# Altium schematic sheet VCO_HMC8364.SchDoc
size A3; SheetNumber: 15; SheetTotal: 26
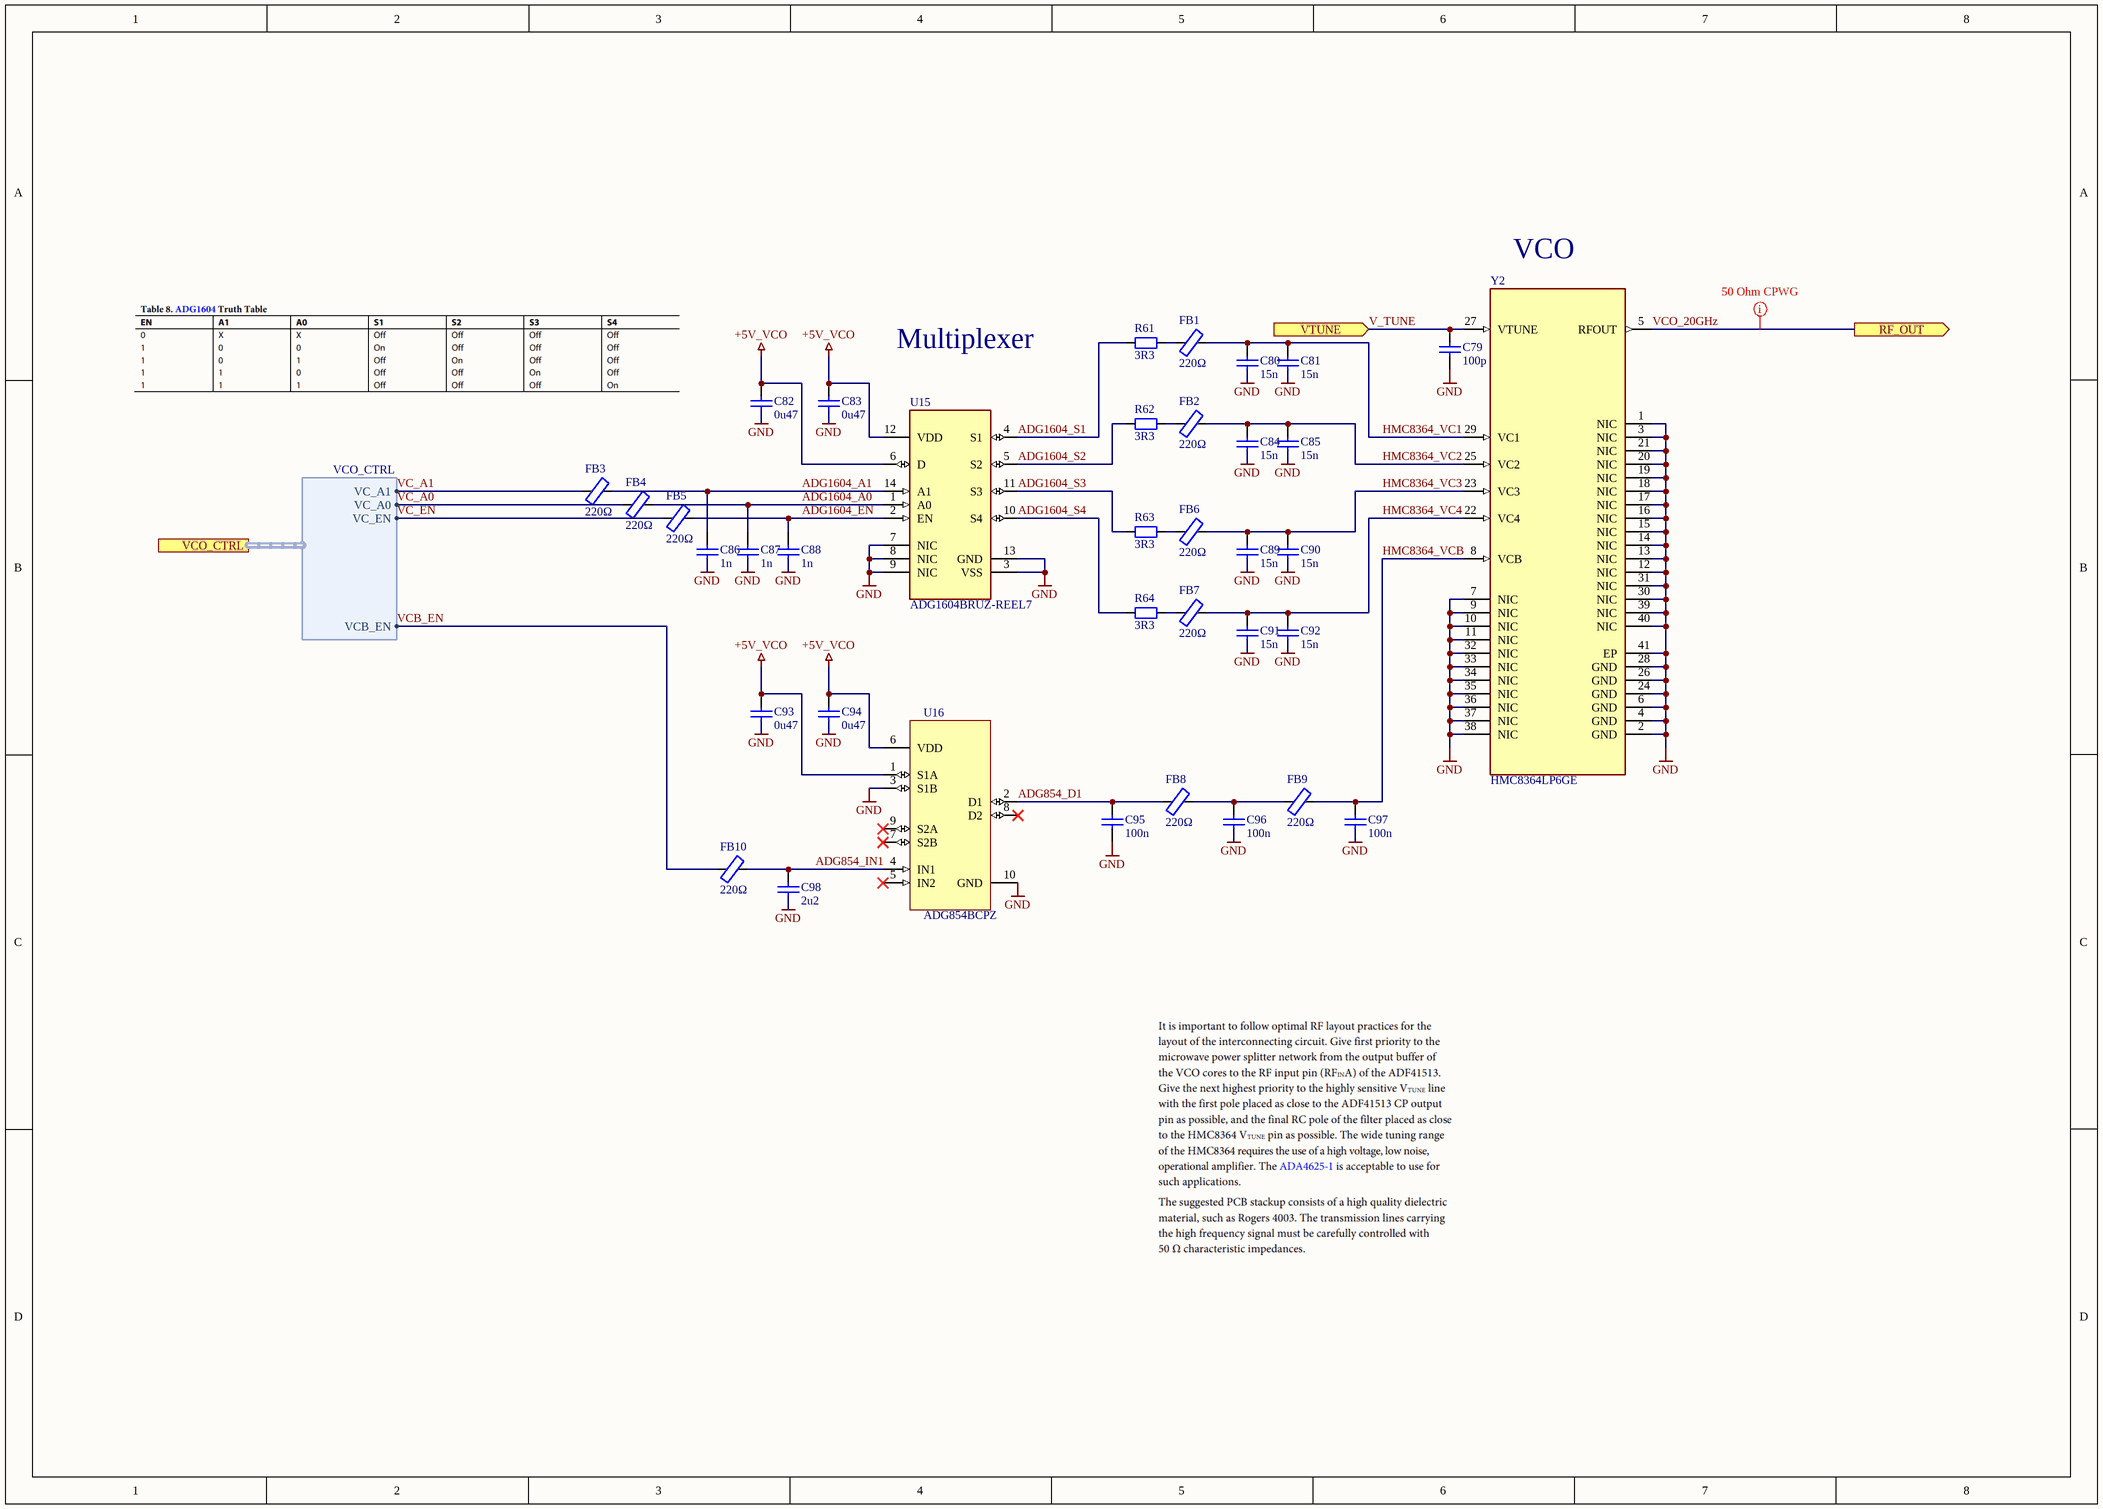
[diagram p0: VCO_HMC8364.SchDoc]

## Parts
C79  100p  [C_0402_1005Metric_IPC_N]
C80  15n  [C_0402_1005Metric_IPC_N]
C81  15n  [C_0402_1005Metric_IPC_N]
C82  0u47  [C_0402_1005Metric_IPC_N]
C83  0u47  [C_0402_1005Metric_IPC_N]
C84  15n  [C_0402_1005Metric_IPC_N]
C85  15n  [C_0402_1005Metric_IPC_N]
C86  1n  [C_0402_1005Metric_IPC_N]
C87  1n  [C_0402_1005Metric_IPC_N]
C88  1n  [C_0402_1005Metric_IPC_N]
C89  15n  [C_0402_1005Metric_IPC_N]
C90  15n  [C_0402_1005Metric_IPC_N]
C91  15n  [C_0402_1005Metric_IPC_N]
C92  15n  [C_0402_1005Metric_IPC_N]
C93  0u47  [C_0402_1005Metric_IPC_N]
C94  0u47  [C_0402_1005Metric_IPC_N]
C95  100n  [C_0402_1005Metric_IPC_N]
C96  100n  [C_0402_1005Metric_IPC_N]
C97  100n  [C_0402_1005Metric_IPC_N]
C98  2u2  [C_0402_1005Metric_IPC_N]
FB1  220Ω  [L_0402_1005Metric_IPC_N]
FB2  220Ω  [L_0402_1005Metric_IPC_N]
FB3  220Ω  [L_0402_1005Metric_IPC_N]
FB4  220Ω  [L_0402_1005Metric_IPC_N]
FB5  220Ω  [L_0402_1005Metric_IPC_N]
FB6  220Ω  [L_0402_1005Metric_IPC_N]
FB7  220Ω  [L_0402_1005Metric_IPC_N]
FB8  220Ω  [L_0402_1005Metric_IPC_N]
FB9  220Ω  [L_0402_1005Metric_IPC_N]
FB10  220Ω  [L_0402_1005Metric_IPC_N]
R61  3R3  [R_0402_1005Metric_IPC_N]
R62  3R3  [R_0402_1005Metric_IPC_N]
R63  3R3  [R_0402_1005Metric_IPC_N]
R64  3R3  [R_0402_1005Metric_IPC_N]
U15  ADG1604BRUZ-REEL7  [TSSOP65P640X120-14N]
U16  ADG854BCPZ  [LFCSP_UQ-10-1EP_1.3x1.6mm_P0.4mm_IPC_N]
Y2  HMC8364LP6GE  [LFCSP-40-1EP_6x6mm_P0.5mm_EP4.7x4.7mm_IPC_N]

## Ports
RF_OUT (out, see Top_Level[4B]), VCO_CTRL (harness VCO_CTRL, see Top_Level[3B], MCU[5C]), VTUNE (in, see Top_Level[3B])

## Harnesses
VCO_CTRL: VC_A1, VC_A0, VC_EN, VCB_EN

## Nets
+5V_VCO: C82.2 C83.2 C93.2 C94.2 U15.6(D) U15.12(VDD) U16.1(S1A) U16.6(VDD)
GND: C79.1 C80.1 C81.1 C82.1 C83.1 C84.1 C85.1 C86.1 C87.1 C88.1 C89.1 C90.1 C91.1 C92.1 C93.1 C94.1 C95.1 C96.1 C97.1 C98.1 U15.3(VSS) U15.7(NIC) U15.8(NIC) U15.9(NIC) U15.13(GND) U16.3(S1B) U16.10(GND) Y2.1(NIC) Y2.2(GND) Y2.3(NIC) Y2.4(GND) Y2.6(GND) Y2.7(NIC) Y2.9(NIC) Y2.10(NIC) Y2.11(NIC) Y2.12(NIC) Y2.13(NIC) Y2.14(NIC) Y2.15(NIC) Y2.16(NIC) Y2.17(NIC) Y2.18(NIC) Y2.19(NIC) Y2.20(NIC) Y2.21(NIC) Y2.24(GND) Y2.26(GND) Y2.28(GND) Y2.30(NIC) Y2.31(NIC) Y2.32(NIC) Y2.33(NIC) Y2.34(NIC) Y2.35(NIC) Y2.36(NIC) Y2.37(NIC) Y2.38(NIC) Y2.39(NIC) Y2.40(NIC) Y2.41(EP)
ADG854_D1: C95.2 FB8.1 U16.2(D1)
ADG854_IN1: C98.2 FB10.2 U16.4(IN1)
ADG1604_A0: C87.2 FB4.2 U15.1(A0)
ADG1604_A1: C86.2 FB3.2 U15.14(A1)
ADG1604_EN: C88.2 FB5.2 U15.2(EN)
ADG1604_S1: R61.1 U15.4(S1)
ADG1604_S2: R62.1 U15.5(S2)
ADG1604_S3: R63.1 U15.11(S3)
ADG1604_S4: R64.1 U15.10(S4)
HMC8364_VC1: C80.2 C81.2 FB1.2 Y2.29(VC1)
HMC8364_VC2: C84.2 C85.2 FB2.2 Y2.25(VC2)
HMC8364_VC3: C89.2 C90.2 FB6.2 Y2.23(VC3)
HMC8364_VC4: C91.2 C92.2 FB7.2 Y2.22(VC4)
HMC8364_VCB: C97.2 FB9.2 Y2.8(VCB)
V_TUNE: C79.2 Y2.27(VTUNE) ; port VTUNE
VC_A0: FB4.1 ; port VCO_CTRL.VC_A0
VC_A1: FB3.1 ; port VCO_CTRL.VC_A1
VC_EN: FB5.1 ; port VCO_CTRL.VC_EN
VCB_EN: FB10.1 ; port VCO_CTRL.VCB_EN
VCO_20GHz: Y2.5(RFOUT) ; port RF_OUT
NetC96_2: C96.2 FB8.2 FB9.1
NetFB1_1: FB1.1 R61.2
NetFB2_1: FB2.1 R62.2
NetFB6_1: FB6.1 R63.2
NetFB7_1: FB7.1 R64.2

Not connected (* = marked no-connect by the designer): U16 5(IN2)* 7(S2B)* 8(D2)* 9(S2A)*

## Layout directives
net class 50Ohm_CPWG: VCO_20GHz

## Notes on the sheet
- VCO
- Multiplexer

## Library data of the parts
C79-C81 C84 C85 C89-C92 C98 = C000002: Generic MLCC with 0402 Footprint; Specific Component: False; Voltage Rated: 50V; ID: C000002; Tolerance: *; Temp Coefficient: *; min Temperature: *; max Temperature: *; Case: 0402
  C79: Capacitance: 100p
  C80 C81 C84 C85 C89-C92: Capacitance: 15n
  C98: Capacitance: 2u2
C82 C86-C88 C93 = C000002: Generic MLCC with 0402 Footprint; Specific Component: False; ID: C000002; Tolerance: *; Temp Coefficient: *; Voltage Rated: *; min Temperature: *; max Temperature: *; Case: 0402
  C82 C93: Capacitance: 0u47
  C86-C88: Capacitance: 1n
C83 C94-C97 = C000002: Generic MLCC with 0402 Footprint; Specific Component: False; Tolerance: 10%; Temp Coefficient: X7R; Voltage Rated: 50V; ID: C000002; min Temperature: *; max Temperature: *; Case: 0402; Supplier 1: Mouser; Supplier Part Number 1: 81-GRM155R71H104KE4D; Supplier 2: Digikey; Supplier Part Number 2: 490-10700-1-ND
  C83 C94: Capacitance: 0u47
  C95-C97: Capacitance: 100n
FB1-FB10 = L000016: Ferrite Beads, 220Ω, 0.3A, *, 700m, *, 0402; Manufacturer: Murata Electronics; Manufacturer Part Number: BLM15GG221SN1D; Specific Component: True; min Temperature: -55; max Temperature: +125; ID: L000016; Type: Ferrite Beads; Inductance: 220Ω; Tolerance: *; Current Rating: 0.3A; Current - Saturation: *; DC resistance: 700m; Q @ Freq: *; Frequency - Self Resonant: *; Case: 0402; ComponentLink1Description: Datasheet; ComponentLink1URL: https://www.mouser.de/datasheet/3/76/1/ENFA0029.pdf; Supplier 1: Digikey; Supplier Part Number 1: 490-5197-1-ND; Supplier 2: Mouser; Supplier Part Number 2: 81-BLM15GG221SN1D
R61-R64 = R000002: Generic Chip Resistor with 0402 Footprint; Specific Component: False; ID: R000002; Resistance: 3R3; Tolerance: *; Power Rating: *; Composition: *; min Temperature: *; max Temperature: *; Temp Coefficient: *; Case: 0402
U15 = LG000020: Manufacturer: Analog Devices; ID: LG000020; Type: Multiplexer; Manufacturer Part Number: ADG1604BRUZ-REEL7; Part Value: ADG1604BRUZ-REEL7; Case: TSSOP-14; ComponentLink1Description: Datasheet; ComponentLink1URL: https://www.analog.com/media/en/technical-documentation/data-sheets/ADG1604.pdf; Supplier 1: Digikey; Supplier Part Number 1: ADG1604BRUZ-REEL7CT-ND; Supplier 2: Mouser; Supplier Part Number 2: 584-ADG1604BRUZ-R7
U16 = LG000021: Manufacturer: Analog Devices; ID: LG000021; Type: Multiplexer; Manufacturer Part Number: ADG854BCPZ; Part Value: ADG854BCPZ; Case: 20-LFCSP_UQ; ComponentLink1Description: Datasheet; ComponentLink1URL: https://www.analog.com/media/en/technical-documentation/data-sheets/ADG854.pdf; Supplier 1: Digikey; Supplier Part Number 1: 505-ADG854BCPZ-REEL7CT-ND; Supplier 2: Mouser; Supplier Part Number 2: 584-ADG854BCPZ-R7
Y2 = Y000004: VCO Oscillators Custom DRT Quad Band VCO 18.2- 26.5 GHz; Manufacturer_Name: Analog Devices; Manufacturer_Part_Number: HMC862ALP3E; Geometry.Height: 0.9mm; Mouser Part Number: 584-HMC862ALP3E; Mouser Price/Stock: https://www.mouser.co.uk/ProductDetail/Analog-Devices/HMC862ALP3E?qs=JeIcUl65ClBGwj3wYTXQsA%3D%3D; Datasheet Link: https://www.mouser.jp/datasheet/2/609/hmc862a-1504252.pdf; ID: Y000004; Type: VCO; Manufacturer Part Number: HMC8364LP6GE; Manufacturer: Analog Devices; Part Value: HMC8364LP6GE; Case: 40-LFCSP (6x6); ComponentLink1Description: Datasheet; ComponentLink1URL: https://www.analog.com/media/en/technical-documentation/data-sheets/hmc8364.pdf; Supplier 1: Digikey; Supplier Part Number 1: 505-HMC8364LP6GE-ND; Supplier 2: Mouser; Supplier Part Number 2: 584-HMC8364LP6GE